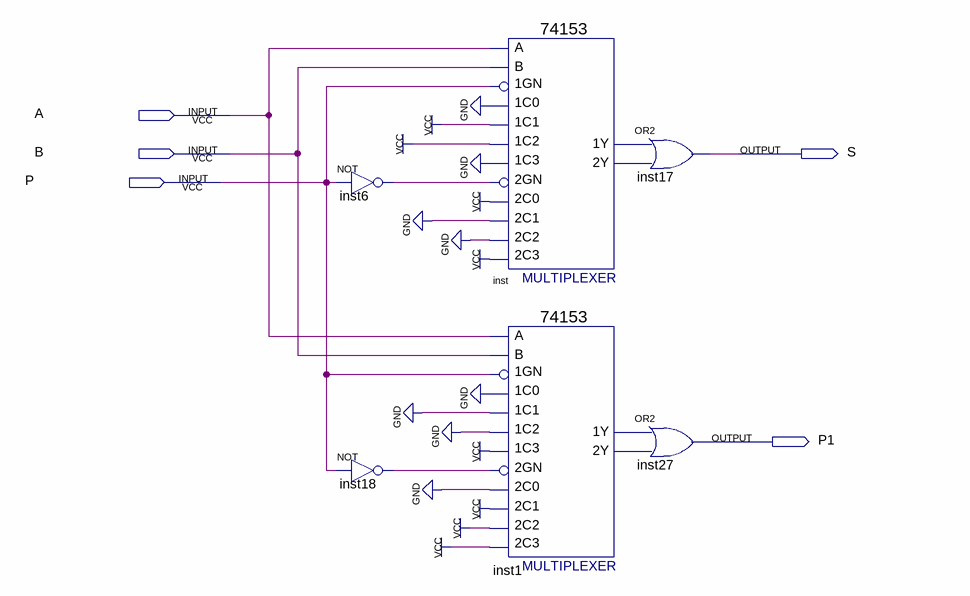
[diagram p0: schematic sheet]
// Quartus schematic sumator.bdf as structural Verilog: 6 symbols, 5 pins
module sumator (
  input  A,
  input  B,
  input  P,
  output S,
  output P1
);

  wire inst1_1y, inst1_2y, inst6_out, inst18_out, inst_1y, inst_2y;

  not inst6 (inst6_out, P);
  not inst18 (inst18_out, P);
  \74153  inst (
    .\1C1 (1'b1), .\1GN (P), .\1C0 (1'b0), .\2C0 (1'b1), .\2GN (inst6_out), .\2C2 (1'b0), .\1C2 (1'b1),
    .\1C3 (1'b0), .B(B), .A(A), .\2C1 (1'b0), .\2C3 (1'b1), .\1Y (inst_1y), .\2Y (inst_2y));
  \74153  inst1 (
    .\1C1 (1'b0), .\1GN (P), .\1C0 (1'b0), .\2C0 (1'b0), .\2GN (inst18_out), .\2C2 (1'b1), .\1C2 (1'b0),
    .\1C3 (1'b1), .B(B), .A(A), .\2C1 (1'b1), .\2C3 (1'b1), .\1Y (inst1_1y), .\2Y (inst1_2y));
  or inst17 (S, inst_1y, inst_2y);
  or inst27 (P1, inst1_1y, inst1_2y);
endmodule
